# Altium project USB_C_powermeter.PrjPcb
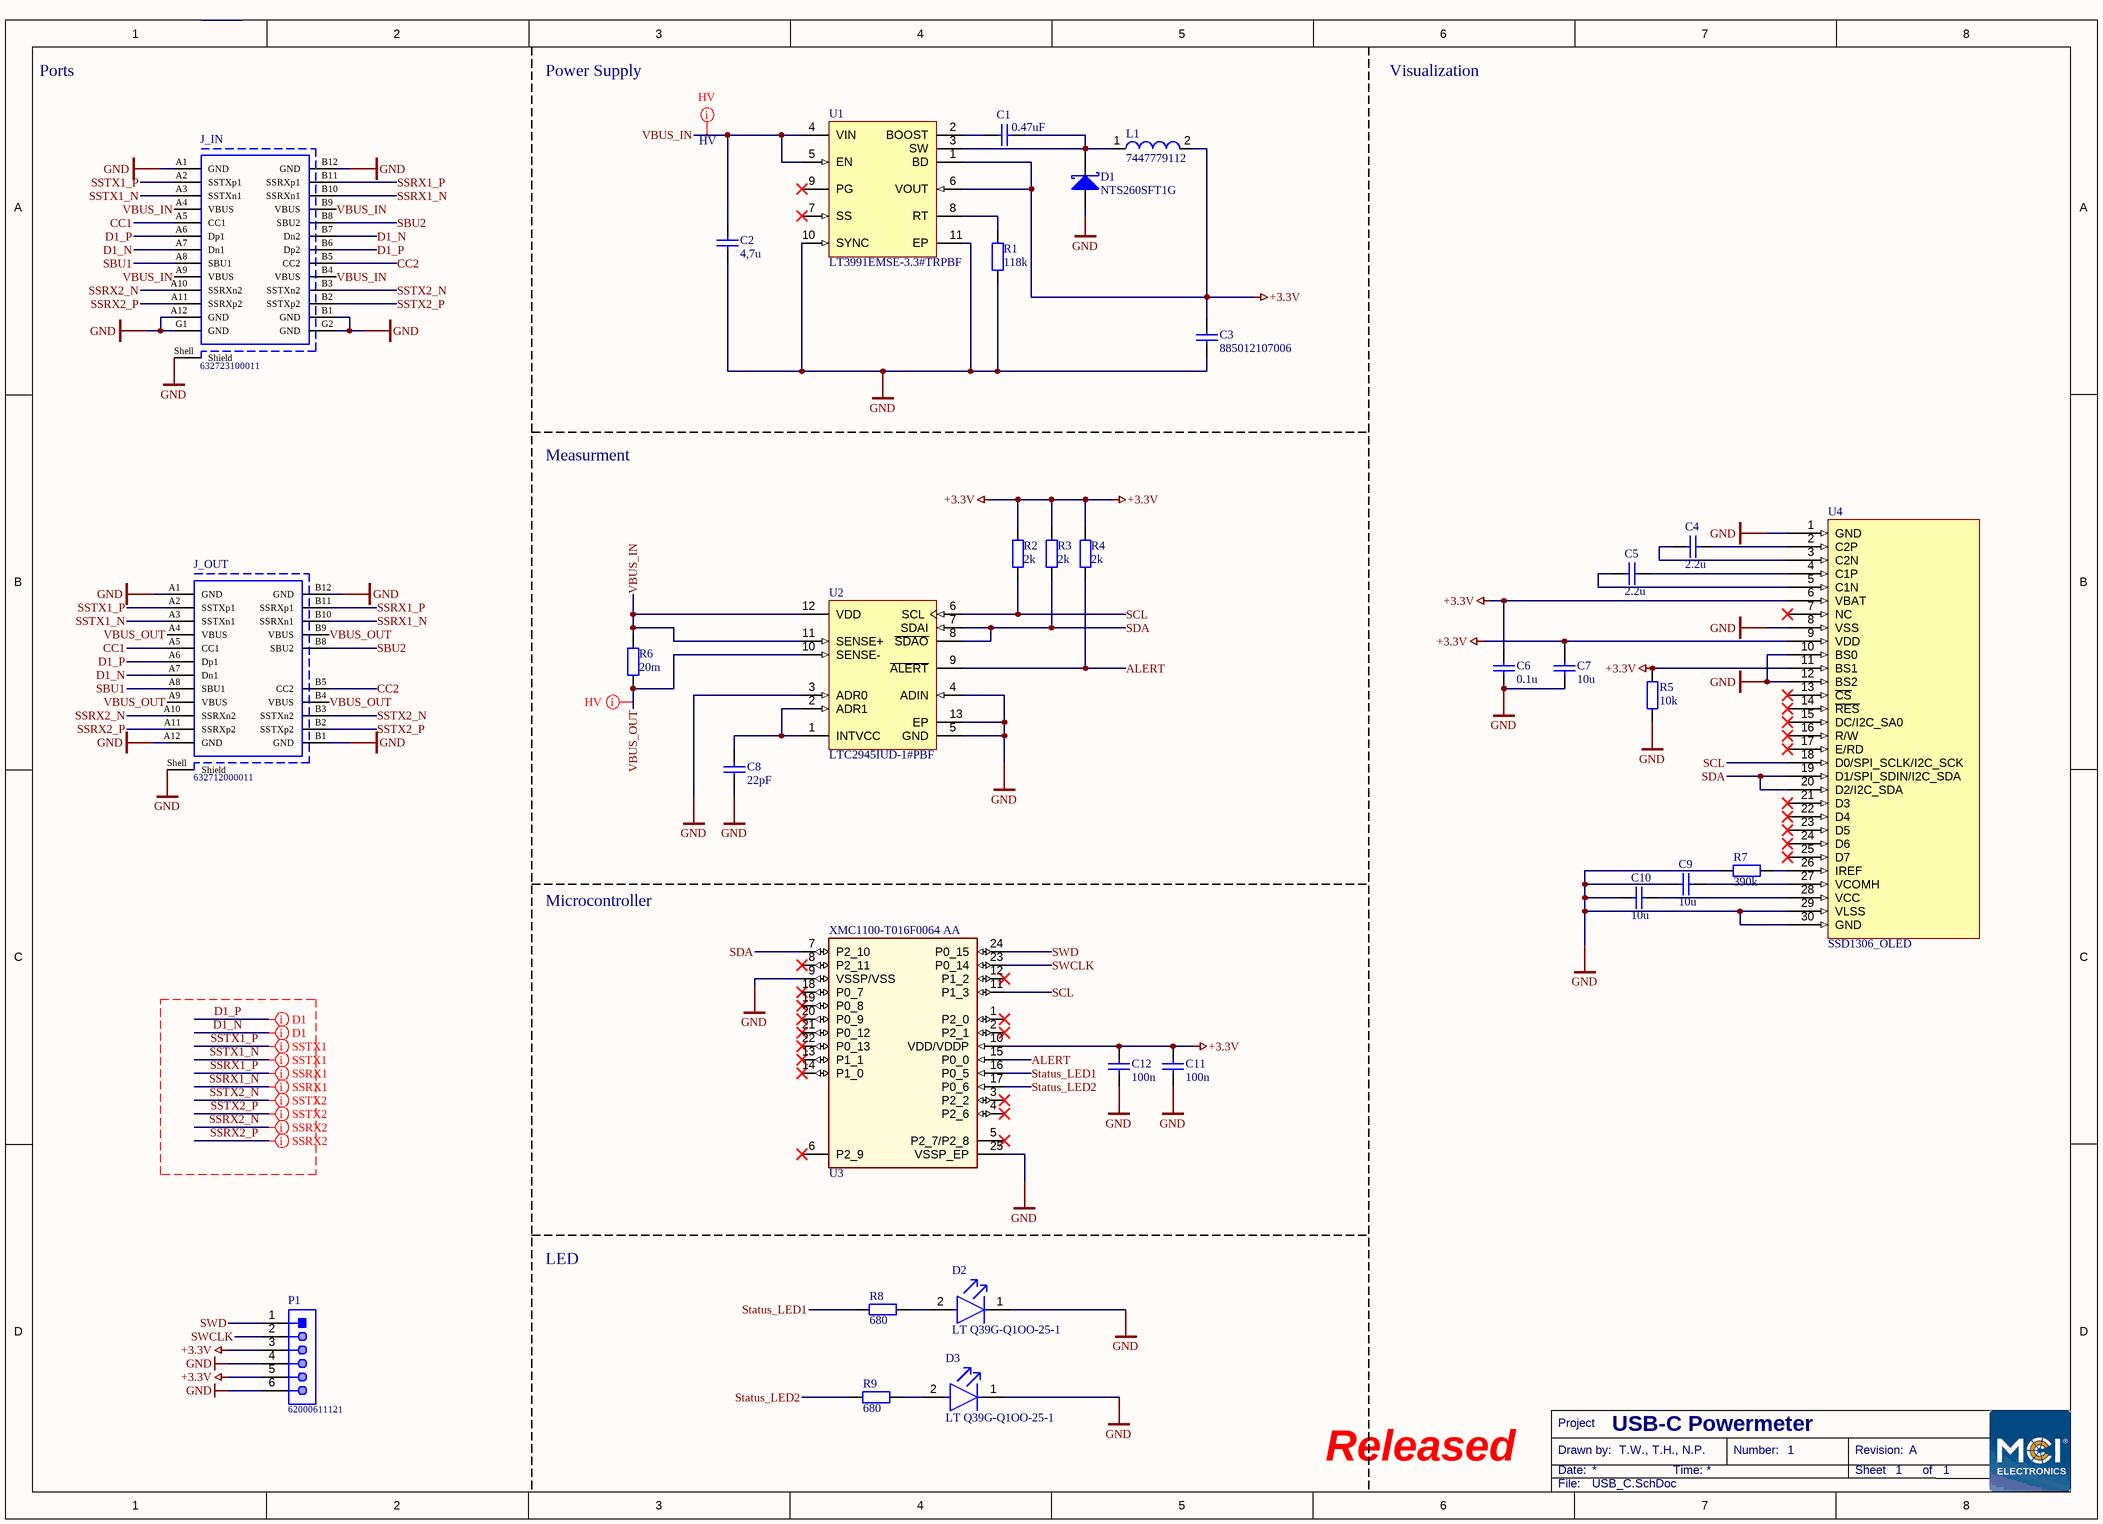
[diagram p0: USB_C.SchDoc]
1 sheet, 32 parts. Net scope: global (net labels, ports and power ports of the same name join across sheets).
Board file: USB_C.PcbDoc

## Sheet USB_C.SchDoc
size A3; DrawnBy: T.W., T.H., N.P.; Organization: MCI; DocumentNumber: 1; Revision: A; SheetNumber: 1; SheetTotal: 1; myStatus: Released; myProjectName: USB-C Powermeter

### Parts
C1  0.47uF  [_0603]
C2  4,7u  [_0805]
C3  885012107006  [_0805]
C4  2.2u  [_0603]
C5  2.2u  [_0603]
C6  0.1u  [_0603]
C7  10u  [_0603]
C8  22pF  [_0603]
C9  10u  [_0603]
C10  10u  [_0603]
C11  100n  [_0603]
C12  100n  [_0603]
D1  NTS260SFT1G  [SOD_123]
D2  LT Q39G-Q1OO-25-1  [FP-LT_Q39G-MFG]
D3  LT Q39G-Q1OO-25-1  [FP-LT_Q39G-MFG]
J_IN  632723100011  [632723100011]
J_OUT  632712000011  [632712000011]
L1  7447779112  [WE-PD-M-PB]
P1  62000611121  [62000611121]
R1  118k  [_0603]
R2  2k  [_0603]
R3  2k  [_0603]
R4  2k  [_0603]
R5  10k  [_0603]
R6  20m  [_2512]
R7  390k  [_0603]
R8  680  [_0603]
R9  680  [_0603]
U1  LT3991EMSE-3.3#TRPBF  [LT-MSE-10-EDP_N]
U2  LTC2945IUD-1#PBF  [LT-UD-12_L]
U3  XMC1100-T016F0064 AA  [QFN50P400X400X90-25N]
U4  SSD1306_OLED  [SSD1306]

### Nets
+3.3V: C3.2 C6.1 C7.1 C11.1 C12.1 L1.2 P1.3 P1.5 R2.1 R3.1 R4.1 R5.2 U1.1(BD) U1.6(VOUT) U3.10(VDD/VDDP) U4.6(VBAT) U4.9(VDD) U4.11(BS1)
GND: C2.1 C3.1 C6.2 C7.2 C8.1 C9.2 C10.2 C11.2 C12.2 D1.1(A) D2.1(C) D3.1(C) J_IN.A1(GND) J_IN.A12(GND) J_IN.B1(GND) J_IN.B12(GND) J_IN.G1(GND) J_IN.G2(GND) J_IN.Shell(Shield) J_OUT.A1(GND) J_OUT.A12(GND) J_OUT.B1(GND) J_OUT.B12(GND) J_OUT.Shell(Shield) P1.4 P1.6 R1.1 R5.1 R7.2 U1.10(SYNC) U1.11(EP) U2.3(ADR0) U2.4(ADIN) U2.5(GND) U2.13(EP) U3.9(VSSP/VSS) U3.25(VSSP_EP) U4.1(GND) U4.8(VSS) U4.10(BS0) U4.12(BS2) U4.29(VLSS) U4.30(GND)
ALERT: R4.2 U2.9(~{ALERT}) U3.15(P0_0)
CC1: J_IN.A5(CC1) J_OUT.A5(CC1)
CC2: J_IN.B5(CC2) J_OUT.B5(CC2)
D1_N: J_IN.A7(Dn1) J_IN.B7(Dn2) J_OUT.A7(Dn1)
D1_P: J_IN.A6(Dp1) J_IN.B6(Dp2) J_OUT.A6(Dp1)
SBU1: J_IN.A8(SBU1) J_OUT.A8(SBU1)
SBU2: J_IN.B8(SBU2) J_OUT.B8(SBU2)
SCL: R2.2 U2.6(SCL) U3.11(P1_3) U4.18(D0/SPI_SCLK/I2C_SCK)
SDA: R3.2 U2.7(SDAI) U2.8(~{SDAO}) U3.7(P2_10) U4.19(D1/SPI_SDIN/I2C_SDA) U4.20(D2/I2C_SDA)
SSRX1_N: J_IN.B10(SSRXn1) J_OUT.B10(SSRXn1)
SSRX1_P: J_IN.B11(SSRXp1) J_OUT.B11(SSRXp1)
SSRX2_N: J_IN.A10(SSRXn2) J_OUT.A10(SSRXn2)
SSRX2_P: J_IN.A11(SSRXp2) J_OUT.A11(SSRXp2)
SSTX1_N: J_IN.A3(SSTXn1) J_OUT.A3(SSTXn1)
SSTX1_P: J_IN.A2(SSTXp1) J_OUT.A2(SSTXp1)
SSTX2_N: J_IN.B3(SSTXn2) J_OUT.B3(SSTXn2)
SSTX2_P: J_IN.B2(SSTXp2) J_OUT.B2(SSTXp2)
Status_LED1: R8.2 U3.16(P0_5)
Status_LED2: R9.2 U3.17(P0_6)
SWCLK: P1.2 U3.23(P0_14)
SWD: P1.1 U3.24(P0_15)
VBUS_IN: C2.2 J_IN.A4(VBUS) J_IN.A9(VBUS) J_IN.B4(VBUS) J_IN.B9(VBUS) R6.1 U1.4(VIN) U1.5(EN) U2.11(SENSE+) U2.12(VDD)
VBUS_OUT: J_OUT.A4(VBUS) J_OUT.A9(VBUS) J_OUT.B4(VBUS) J_OUT.B9(VBUS) R6.2 U2.10(SENSE-)
NetC1_1: C1.1 D1.2(K) L1.1 U1.3(SW)
NetC1_2: C1.2 U1.2(BOOST)
NetC4_1: C4.1 U4.2(C2P)
NetC4_2: C4.2 U4.3(C2N)
NetC5_1: C5.1 U4.4(C1P)
NetC5_2: C5.2 U4.5(C1N)
NetC8_2: C8.2 U2.1(INTVCC) U2.2(ADR1)
NetC9_1: C9.1 U4.27(VCOMH)
NetC10_1: C10.1 U4.28(VCC)
NetD2_2: D2.2(A) R8.1
NetD3_2: D3.2(A) R9.1
NetR1_2: R1.2 U1.8(RT)
NetR7_1: R7.1 U4.26(IREF)

Not connected (* = marked no-connect by the designer): U1 7(SS)* 9(PG)*; U3 1(P2_0)* 2(P2_1)* 3(P2_2)* 4(P2_6)* 5(P2_7/P2_8)* 6(P2_9)* 8(P2_11)* 12(P1_2)* 13(P1_1)* 14(P1_0)* 18(P0_7)* 19(P0_8)* 20(P0_9)* 21(P0_12)* 22(P0_13)*; U4 7(NC)* 13(~{CS})* 14(~{RES})* 15(DC/I2C_SA0)* 16(R/W)* 17(E/RD)* 21(D3)* 22(D4)* 23(D5)* 24(D6)* 25(D7)*

### Layout directives
net class HV; rule Clearance Constraint [Generic clearance = 0.254mm, and 24 value(s) for objects]: VBUS_OUT
net class HV: VBUS_IN
differential pair: D1_N, D1_P, SSRX1_N, SSRX1_P, SSRX2_N, SSRX2_P, SSTX1_N, SSTX1_P, SSTX2_N, SSTX2_P

### Notes on the sheet
- Ports
- Power Supply
- Visualization
- Measurment
- Microcontroller
- LED
- Project
- Date:
- Drawn by:
- Time:
- Number:
- Revision:
- Sheet
- of
- ELECTRONICS
- File:

### Library data of the parts
C1 C4-C12 = Cap_129: Name: Cap_0603; QR: 0; UID: Cap_129; ComponentLink1URL: #WERT!; mounting: SMD
C2 = Cap_116: Name: Cap_cer_1n0_50V; QR: 0; Capacity: 1n0; Voltage: 50V; UID: Cap_116; ComponentLink1URL: #WERT!; mounting: SMD
C3 = Cap_111: Name: Cap_cer_18p_50V; RS_number: 723-6228; QR: 0; Capacity: 18p; Voltage: 50V; UID: Cap_111; Name_Hyperlink: Keramikkondensator SMT 18 pF 50 VDC; ComponentLink1URL: javascript:Richfaces.showModalPanel('quickViewModalPanel', %7burl:'/web/p/products/723-6228',viewMode:'quickView'%7d);; mounting: SMD
D1 = DIODE_4: Name: 11DQ06; Type: Schottky; Current / Power: 1.1 A; RS_number: 254-0702; QR: 1; UID: DIODE_4; Name_Hyperlink: Schottky-Diode 11DQ06; ComponentLink1URL: http://at.rs-online.com/web/search/searchBrowseAction.html?method=getProduct&R=2540702; mounting: THT
D2 D3 = CMP-62016-000026-1: LED GREEN DIFFUSED 0603 SMD; Reverse Voltage: 5V; Test Current: 5mA; Number of Elements: 1; Luminous Flux: 0.55lm; Forward Voltage: 3.2V; Forward Current: 15mA; Luminous Intensity: 280mcd; Dominant Wavelength: 530nm; Depth: 0.9mm; Number of Pins: 2; Mount: Surface Mount; Packaging: Tape and Reel; Lens Style: Diffused; Min Operating Temperature: -40°C; Radiation Hardening: No; Case/Package: SMD/SMT; Max Operating Temperature: 85°C; Number of LEDs: 1; Length: 1.7mm; Color: Green
J_IN = CMP-1502-03213-1: USB 3.1 Type C Receptacle WR-COM, Horizontal, SMT / THT; Manufacturer: Wurth Elektronik; Working Voltage: 20VDC; Rated Current: 5A; Contact Resistance: 30mOhm; Operating Temperature: -40to105degC; Publisher: WurthElektronik; Gender: Receptacle; Part Number: 632723100011; Mounting Technology: SMT/THT; Datasheet URL: https://katalog.we-online.de/em/datasheet/632723x00011%282%29.pdf; Connector Type: USB3.1TypeC; Manufacturer URL: http://www.we-online.de; Orientation: Horizontal; Package Reference: 632723100011; Packaging: TapeandReel
J_OUT = CMP-1502-03215-1: USB 3.1 Type C Plug WR-COM, Horizontal, SMT; Manufacturer: Wurth Elektronik; Contact Resistance: 30mOhm; Rated Current: 5A; Working Voltage: 20VDC; Gender: Plug; Part Number: 632712000011; Operating Temperature: -25to105degC; Mounting Technology: SMT; Packaging: TapeandReel; Manufacturer URL: http://www.we-online.de; Datasheet URL: https://katalog.we-online.de/em/datasheet/632712000011.pdf; Connector Type: USB3.1TypeC; Orientation: Horizontal; Publisher: WurthElektronik; Package Reference: 632712000011
L1 = CMP-0227-00301-1: SMD-Shielded Power Inductor WE-PD, L = 12.0 µH; Inductance: 12.0 ÂµH; PackageReference: WE-PD-M-PB; PackageVersion: 2008; DatasheetVersion: ver 10, Jan-2008; ComponentLink1URL: http://www.we-online.com; ComponentLink2URL: http://www.we-online.de/katalog/media/pdf/7447779112.pdf; ComponentLink1Description: Manufacturer Link; PackageDescription: SMD Inductor, 2-Leads, Body 7.3 x 7.3 mm; ComponentLink2Description: Datasheet
P1 = CMP-1502-00960-1: THT Vertical Pin Header WR-PHD, Pitch 2.00 mm, Single Row, 6 pins; Manufacturer: Wurth Elektronik; Rated Current: 2A; Pitch: 2.00mm; Working Voltage: 200VAC; Withstanding Voltage: 500VAC; Contact Resistance: 20mOhm; Pin Number: 6; Gender: Male; Package Reference: 62000611121; Part Number: 62000611121; Manufacturer URL: http://www.we-online.de; Row Number: Single; Datasheet URL: https://katalog.we-online.de/em/datasheet/62000611121.pdf; Orientation: Vertical; Operating Temperature: -40to105degC; Packaging: Bag; Publisher: WurthElektronik; Mounting Technology: THT
R1-R5 R7-R9 = Res_5: Name: Res_0603; UID: Res_5; ComponentLink1URL: #WERT!; mounting: SMD
R6 = Res_11: Name: Res_2512; UID: Res_11; ComponentLink1URL: #WERT!; mounting: SMD
U1 = CMP-0491-01057-1: 1.2 A Step-Down Regulator with 2.8 uA Quiescent Current, 10-pin SOP (MSE-10-EDP), -40 to 125 degC, Pb-Free, Tape and Reel; Manufacturer: Linear Technology; Frequency Adjust Range: 200kHz - 2MHz; Number of Outputs: 1; ComponentLink2URL: http://cds.linear.com/docs/en/datasheet/3991fa.pdf; DatasheetVersion: Rev. A; ComponentLink2Description: Datasheet; PackageReference: MSE-10; ComponentLink1Description: Manufacturer URL; RoHS: TRUE; ComponentLink1URL: http://www.linear.com/; PackageVersion: Rev. I, 05/2013; Packing: Tape and Reel; ComponentLink3Description: Package Specification; ComponentLink3URL: http://cds.linear.com/docs/en/packaging/05081664_I_MSE.pdf; PartNumber: LT3991EMSE-3.3#TRPBF; PackageDescription: 10-Pin Plastic MSOP, Exposed Die Pad, Body 3 x 3 mm, Pitch 0.5 mm; Mounting Technology: Surface Mount
U2 = CMP-0482-01542-1: Wide Range I2C Power Monitor, 12-pin QFN (UD-12), -40 to 85 degC, Pb-Free; Manufacturer: Linear Technology; Number of Supplies(#): 1; ComponentLink2Description: Datasheet; Mounting Technology: Surface Mount; Code_JEDEC: MO-220; ComponentLink1Description: Manufacturer URL; PackageReference: UD-12; ComponentLink3Description: Package Specification; PartNumber: LTC2945IUD-1#PBF; ComponentLink3URL: http://cds.linear.com/docs/en/packaging/QFN_12_%2005-08-1855.pdf; PackageVersion: Rev. Ã˜, 06/2010; ComponentLink1URL: http://www.linear.com/; RoHS: TRUE; PackageDescription: 12-Pin Plastic QFN, Body 3 x 3 mm, Pitch 0.5 mm; ComponentLink2URL: http://cds.linear.com/docs/en/datasheet/2945f.pdf
U3 = XMC1100-Q024F0064 AA: 32-bit XMC1000 Industrial Microcontrollers ARM® Cortex™-M0 / PG-VQFN-24-19; Manufacturer: Infineon; Digital I/O Lines: 22; DSP functionality (e.g MDU/MAC): FALSE; E2PROM Emulation (Data-Flash): TRUE; I/O Operation Voltages: 3.3 V, 5.0 V; Instruction set architecture: ARM Cortex-M0; Instruction width [bits]: 32/16; Max Clock Frequency: 32 MHz; Number of ADC Modules: 1; Program Memory: 64.0 KByte; Serial I/O Interfaces: 2; Type of Memory: Flash; Type of Serial I/O Interfaces: SPI(2), Dual SPI, Quad SPI, UART, I2C, I2S; Power Modes: clock gating possible; A / D input lines: 8; Comment/Add. Features: Temp. Sensor; CAN Nodes: 0; LIN BSL loader (for fast Flash programming): FALSE; Timer / Counter: 4; DatasheetVersion: Rev. 1.4; Green: TRUE; Halogen-free: TRUE; On-chip clock generation: TRUE; On-chip Voltage Regulator: TRUE; Oscillator Watchdog: TRUE; PackageDescription: 24-Pin Plastic (Green) Plastic (Green) Very Thin Profile Quad Flat Non Leaded Package, Body 4.0 x 4.0 mm, Pitch 0.5 mm; PackageReference: PG-VQFN-24-13; PackageVersion: V1.4, 05/2014; PartNumber: XMC1100-Q024F 0064 AA; Real Time Clock (RTC): TRUE; SRAM (incl. Cache): 64.0 KByte; Timed I/O Pins (PWM-Ch,CAPCOM): 22; Touch / LED Matrix control: FALSE; Watchdog Timer: TRUE; ComponentLink2Description: Datasheet; ComponentLink2URL: http://www.infineon.com/dgdl/xmc1100_ds_v1.4_2014_05.pdf?folderId=db3a30433580b3710135a47f3eb76c98&fileId=db3a30433d1d0bbe013d256b60160b7f&ack=t; ComponentLink3Description: Package Specification; ComponentLink3URL: http://www.infineon.com/cms/en/product/microcontroller/32-bit-industrial-microcontroller-based-on-arm-registered-cortex-tm-m/32-bit-xmc1000-industrial-microcontroller-arm-registered-cortex-tm-m0/channel.html?channel=db3a30433c1a8752013c1aa35a6a0029&tab=2; Mounting Technology: Surface Mount; DMA Channels: 0; External Bus interface: FALSE; FlexRay<sup>TM</sup>: FALSE; Floating Point Unit: FALSE; Peripheral Control Processor (PCP): FALSE; Temperature range: -40 to 85°C